# Altium schematic sheet GRM155R71H104KE14D1_GRM155R71H104KE14D.schdoc
size 127 x 101 mm
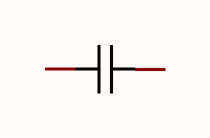
[diagram p0: GRM155R71H104KE14D1_GRM155R71H104KE14D.schdoc]

## Parts
C?  100nF  [C0402]  (value not drawn)

## Nets

Not connected (* = marked no-connect by the designer): C? 1 2

## Library data of the parts
C? = GRM155R71H104KE14D: Manufacturer: muRata(村田); Add into BOM: yes; Tolerance: ±10%; Voltage Rated: 50V; Temperature Coefficient: X7R; Symbol: GRM155R71H104KE14D; Device: GRM155R71H104KE14D; LCSC Part Name: 100nF ±10% 50V; Supplier Part: C77020; Manufacturer Part: GRM155R71H104KE14D; Supplier Footprint: 0402; JLCPCB Part Class: Extended Part; Datasheet: https://atta.szlcsc.com/upload/public/pdf/source/20180326/C77020_39BD49C951FF1AF0DB1F1FAC5AC1E401.pdf; Supplier: LCSC; Convert to PCB: yes; Value: 100nF